# EasyEDA Pro project PCB.eprj

# Schematic Schematic1
Board Name: Board1; Create Date: 2025-12-08; Page Name: P1; Project Name: 微型显示器-401RCT6; Schematic Name: Schematic1; Update Date: 2025-12-23; Company: 嘉立创EDA; Page Size: A4; Version: V1.0
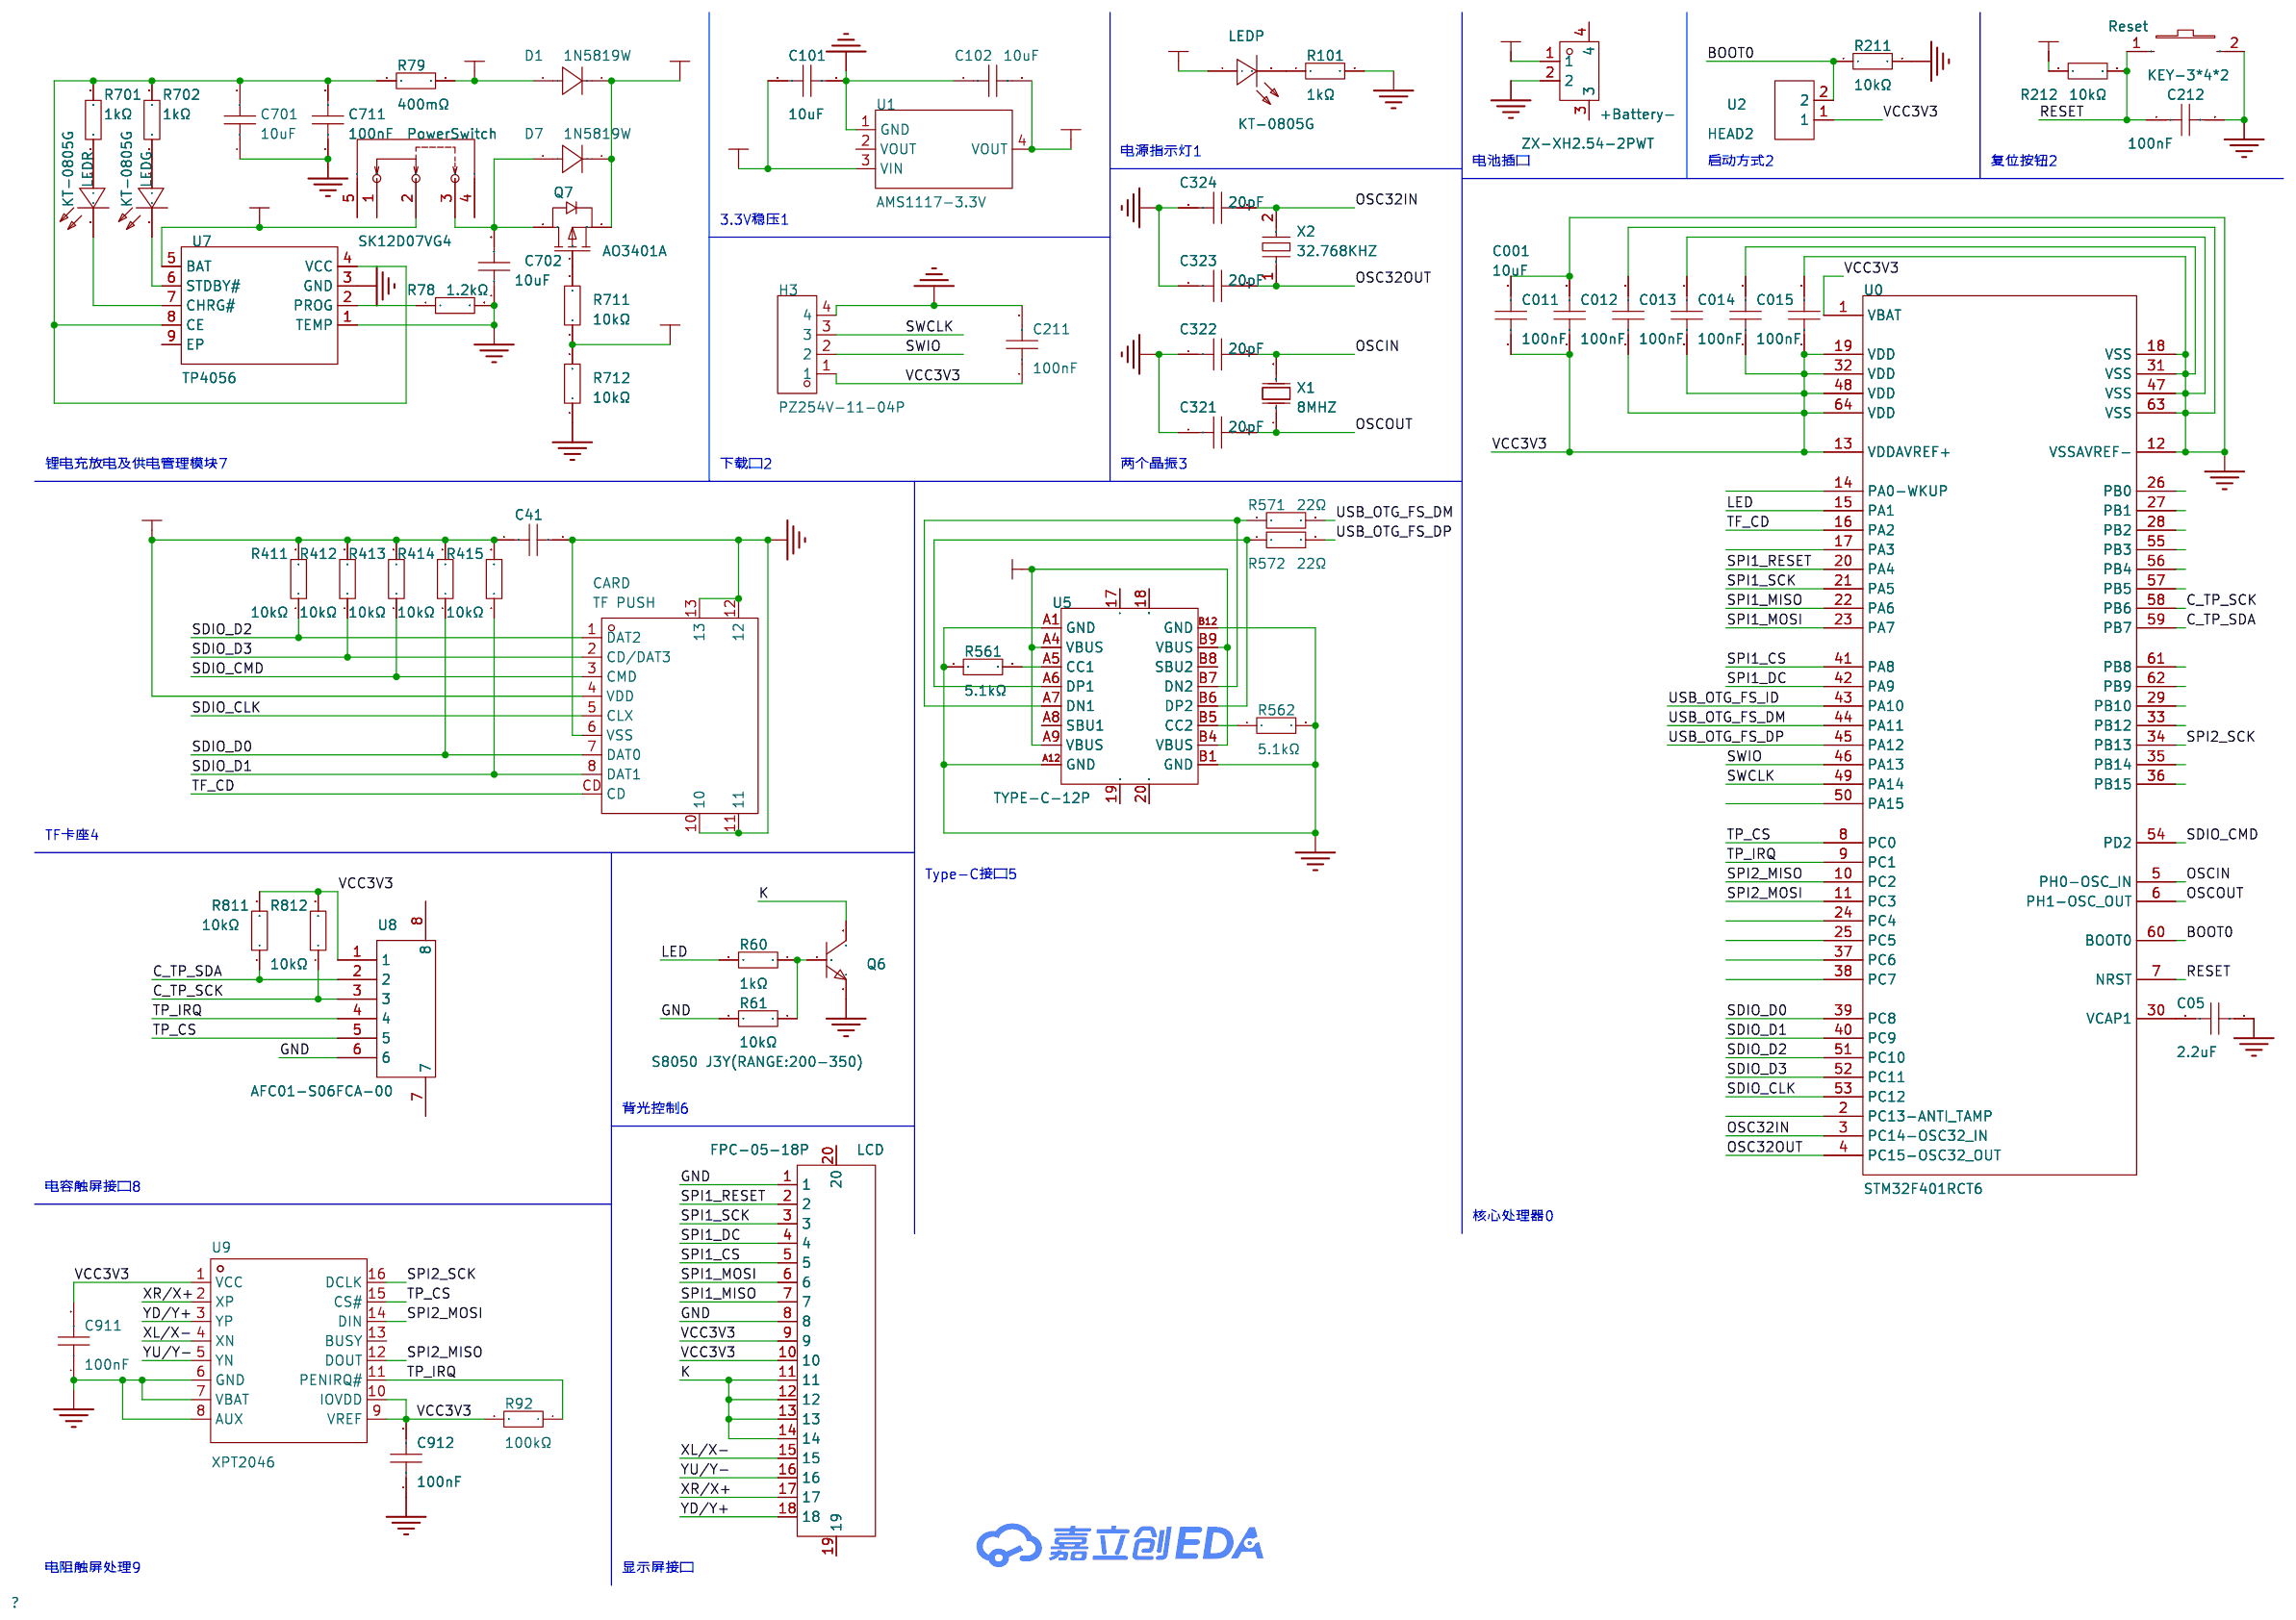
[diagram p0: schematic sheet]

## Parts
+Battery-  ZX-XH2.54-2PWT  [CONN-SMD_2P-P2.54_MEGASTAR_ZX-XH2.54-2PWT]
C001  10uF  [C0603]
C05  2.2uF  [C0603]
C011  100nF  [C0603]
C012  100nF  [C0603]
C013  100nF  [C0603]
C014  100nF  [C0603]
C015  100nF  [C0603]
C41  100nF  [C0603]
C101  10uF  [C0603]
C102  10uF  [C0603]
C211  100nF  [C0603]
C212  100nF  [C0603]
C321  20pF  [C0603]
C322  20pF  [C0603]
C323  20pF  [C0603]
C324  20pF  [C0603]
C701  10uF  [C0603]
C702  10uF  [C0603]
C711  100nF  [C0603]
C911  100nF  [C0603]
C912  100nF  [C0603]
CARD  TF PUSH  [TF-SMD_TF-PUSH]
D1  1N5819W  [SOD-123_L2.7-W1.6-LS3.7-FD]
D7  1N5819W  [SOD-123_L2.7-W1.6-LS3.7-FD]
H3  PZ254V-11-04P  [HDR-TH_4P-P2.54-V-M]
LCD  FPC-05-18P  [FPC-SMD_18P-P0.50_XW05200-18]
LEDG  KT-0805G  [LED0805-R-RD]
LEDP  KT-0805G  [LED0805-R-RD]
LEDR  KT-0805G  [LED0805-R-RD]
PowerSwitch  SK12D07VG4  [SW-TH_SK12D07VG4]
Q6  S8050 J3Y(RANGE:200-350)  [SOT-23-3_L3.0-W1.7-P0.95-LS2.9-BR]
Q7  AO3401A  [SOT-23_L2.9-W1.3-P1.90-LS2.4-BR]
R60  1kΩ  [R0603]
R61  10kΩ  [R0603]
R78  1.2kΩ  [R0603]
R79  400mΩ  [R0603]
R92  100kΩ  [R0603]
R101  1kΩ  [R0603]
R211  10kΩ  [R0603]
R212  10kΩ  [R0603]
R411  10kΩ  [R0603]
R412  10kΩ  [R0603]
R413  10kΩ  [R0603]
R414  10kΩ  [R0603]
R415  10kΩ  [R0603]
R561  5.1kΩ  [R0603]
R562  5.1kΩ  [R0603]
R571  22Ω  [R0603]
R572  22Ω  [R0603]
R701  1kΩ  [R0603]
R702  1kΩ  [R0603]
R711  10kΩ  [R0603]
R712  10kΩ  [R0603]
R811  10kΩ  [R0603]
R812  10kΩ  [R0603]
Reset  KEY-3*4*2  [SW-SMD_L4.0-W2.9-LS5.0]
U0  STM32F401RCT6  [LQFP-64_L10.0-W10.0-P0.50-LS12.0-BL]
U1  AMS1117-3.3V  [SOT-223-3_L6.5-W3.4-P2.30-LS7.0-BR]
U2  HEAD2  [HDR-TH_2P-P2.54-V-M]
U5  TYPE-C-12P  [USB-SMD_TYPE-C16PIN]
U7  TP4056  [ESOP-8_L4.9-W3.9-P1.27-LS6.0-BL-EP3.1]
U8  AFC01-S06FCA-00  [FPC-SMD_P0.50-6P_AFC01-S06FCA-00]
U9  XPT2046  [TSSOP-16_L5.0-W4.4-P0.65-LS6.4-BL]
X1  8MHZ  [HC-49S_L11.5-W5.0-P4.88]
X2  32.768KHZ  [CRYSTAL-SMD_L3.2-W1.5-1]

## Library data of the parts
+Battery- = ZX-XH2.54-2PWT: 插针结构:1x2P;间距:2.5mm;安装方式:卧贴;参考系列:XH;总PIN数:2P;排数:1;每排PIN数:2;行距:-;额定电流:3A;触头材质:黄铜;触头镀层:锡;工作温度:-25℃~+85℃;; LCSC Part Name: 1x2P 间距:2.5mm 卧贴 系列:XH; Supplier Part: C7429671; Manufacturer: Megastar(兆星); Supplier Footprint: SMD,P=2.5mm,卧贴; JLCPCB Part Class: 扩展库; Datasheet: https://item.szlcsc.com/datasheet/ZX-XH2.54-2PWT/8427588.html; Supplier: LCSC; Pins Structure: 1x2P; Pitch: 2.5mm; Mounting Type: 卧贴; Reference Series: XH; Number of Pins: 2P; Number of Rows: 1; Number of PINs Per Row: 2; Current Rating: 3A; Contact Material: 黄铜; Contact Plating: 锡; Operating Temperature: -25℃~+85℃; Voltage Rating: 250V; Supplementary Features: 辅助焊脚; Color: 米色; Z-Height of the Board: 6.2mm; X-Length of Bottom Edge on Board (Spacing Line): 10mm; Y-Width of Bottom Edge on Board: 10.5mm
C001 C101 C102 C701 C702 = CGA0603X5R106K100JT: 容值:10uF;精度:±10%;额定电压:10V;温度系数:X5R;; LCSC Part Name: 10uF ±10% 10V; Supplier Part: C6119842; Manufacturer: HRE(芯声); Supplier Footprint: 0603; JLCPCB Part Class: Extended Part; Supplier: LCSC; Tolerance: ±10%; Voltage Rating: 10V; Temperature Coefficient: X5R
C05 = CL10A225KO8NNNC: LCSC Part Name: 2.2uF ±10% 16V; Supplier Part: C23630; Manufacturer: SAMSUNG(三星); Supplier Footprint: 0603; JLCPCB Part Class: Basic Part; Datasheet: https://item.szlcsc.com/datasheet/CL10A225KO8NNNC/24366.html; Supplier: LCSC; Tolerance: ±10%; Voltage Rating: 16V; Temperature Coefficient: X5R
C011 C012 C013 C014 C015 C41 C211 C212 C711 C911 C912 = CGA0603X7R104K500JT: 容值:100nF;精度:±10%;额定电压:50V;温度系数:X7R;; LCSC Part Name: 100nF ±10% 50V; Supplier Part: C6119867; Manufacturer: HRE(芯声); Supplier Footprint: 0603; JLCPCB Part Class: Extended Part; Datasheet: https://atta.szlcsc.com/upload/public/pdf/source/20250103/C44077DA9E7B3EFAE02F22B6D3D1CBC9.pdf; Supplier: LCSC; Tolerance: ±10%; Voltage Rating: 50V; Temperature Coefficient: X7R
C321-C324 = CC0603JRNPO9BN200: 容值:20pF;精度:±5%;额定电压:50V;材质(温度系数):NP0;; LCSC Part Name: 20pF ±5% 50V; Supplier Part: C105621; Manufacturer: YAGEO(国巨); Supplier Footprint: 0603; JLCPCB Part Class: Extended Part; Datasheet: https://atta.szlcsc.com/upload/public/pdf/source/20170505/1493957838062.pdf; Supplier: LCSC; Tolerance: ±5%; Voltage Rated: 50V; Temperature Coefficient: NP0
CARD = TF PUSH: 卡连接方式:自弹式;卡类型:MicroSD卡(TF卡);连接器类型:卡座;本体最大高度:2mm;工作温度:-25℃~+90℃;; LCSC Part Name: 自弹式 MicroSD卡(TF卡) 卡座; Supplier Part: C393941; Manufacturer: SHOU HAN(首韩); Supplier Footprint: SMD; JLCPCB Part Class: 扩展库; Datasheet: https://item.szlcsc.com/datasheet/TF%2520PUSH/372553.html; Supplier: LCSC; Card Connection Mode: 自弹式; Card Type: MicroSD卡(TF卡); Connector Type: 卡座; Additional Card Detection Pins: 无; Height Above Board: 2mm; Operating Temperature: -25℃~+90℃
D1 D7 = 1N5819W_C5451628: 二极管配置:独立式;正向压降(Vf):600mV@200mA;直流反向耐压(Vr):40V;整流电流:350mA;; LCSC Part Name: 电压:40V 电流:350mA; Supplier Part: C5451628; Manufacturer: HXY MOSFET(华轩阳电子); Supplier Footprint: SOD-123; JLCPCB Part Class: Extended Part; Datasheet: https://item.szlcsc.com/datasheet/1N5819W/6355371.html; Supplier: LCSC; Diode Configuration: 独立式; Voltage - Forward(Vf@If): 600mV@200mA; Voltage - DC Reverse(Vr): 40V; Current - Rectified: 350mA; Reverse Leakage Current (Ir): 5uA@30V
H3 = PZ254V-11-04P_C492403: LCSC Part Name: 1x4P 间距:2.54mm 方针 直插; Supplier Part: C492403; Manufacturer: XFCN(兴飞); Supplier Footprint: 插件,P=2.54mm; JLCPCB Part Class: Extended Part; Datasheet: https://atta.szlcsc.com/upload/public/pdf/source/20200309/C492403_F9F19131791D08044AD4F84F8E751A34.pdf; Supplier: LCSC; Pin Structure: 1x4P; Pitch: 2.54mm; Circluar Pins/Square Pins: 方针; Mounting Type: 直插; Number of Rows: 单排; Number of Pins: 4P; Length of Mating Pin: 6mm; Insulation Height: 2.5mm; Length of End Connection Pin: 3mm; Contact Material: 黄铜; Operating Temperature: -40℃~+105℃; Color: 黑色
LCD = FPC-05-18P: Supplier Part: C9900014287; JLCPCB Part Class: Extended Part; Supplier: LCSC
LEDG LEDP LEDR = KT-0805G: 灯头类型:-;发光颜色:翠绿色;正向压降(Vf):2.6V~3.1V;功率:100mW;正向电流:5mA;波长:513nm~528nm;二极管配置:-;透镜颜色:-;色温:-;发光强度:430mcd;发光角度:120°;载带方式:-;工作温度:-40℃~+85℃;; LCSC Part Name: 0805 翠绿 高亮; Supplier Part: C2297; Manufacturer: KENTO; Supplier Footprint: 0805; JLCPCB Part Class: 基础库; Datasheet: https://item.szlcsc.com/datasheet/KT-0805G/2670.html; Supplier: LCSC; Illumination Color: 翠绿色; Voltage - Forward(Vf): 2.6V~3.1V; Power(Watts): 100mW; Forward Current: 5mA; Wavelength - Dominant: 513nm~528nm; Peak Wavelength: 525nm; Luminous Intensity: 430mcd; Viewing Angle: 120°; Operating Temperature: -40℃~+85℃
PowerSwitch = SK12D07VG4: 电路结构:单刀双掷;安装方式:-;额定电流:500mA;额定电压:50V;工作寿命:5千次;; LCSC Part Name: 3脚2档位 卧插 滑动开关; Supplier Part: C393937; Manufacturer: SHOU HAN(首韩); Supplier Footprint: 插件; JLCPCB Part Class: 扩展库; Datasheet: https://item.szlcsc.com/datasheet/SK12D07VG4/372549.html; Supplier: LCSC; Circuit: 单刀双掷; Actuator Style: 矩形柱状; Termination Style: PC引脚; Switch Height: 8.8mm; Current Rating: 500mA; Voltage Rating: 50V; Life: 5千次; Length: 8.7mm
Q6 = S8050 J3Y(RANGE:200-350): LCSC Part Name: H档(200-350) NPN 电流:0.5A 电压:25V; Supplier Part: C2146; Manufacturer: CJ(江苏长电/长晶); Supplier Footprint: SOT-23; JLCPCB Part Class: 基础库; Datasheet: https://item.szlcsc.com/datasheet/S8050%2520J3Y(RANGE%253A200-350)/2503.html; Supplier: LCSC; type: NPN; Current - Collector(Ic): 500mA; Collector - Emitter Voltage VCEO: 25V; Pd - Power Dissipation: 300mW; DC Current Gain: 200@500mA,1V; Transition frequency(fT): 150MHz; Current - Collector Cutoff: 100nA; Vce Saturation(VCE(sat)): 600mV@500mA,50mA; Operating Temperature: -55℃~+150℃; Emitter-Base Voltage(Vebo): 5V; Number: 1个NPN
Q7 = AO3401A_C347476: 数量:1个P沟道;漏源电压(Vdss):30V;连续漏极电流(Id):4.2A;导通电阻(RDS(on)):50mΩ@10V;耗散功率(Pd):1.4W;阈值电压(Vgs(th)):1.3V@250uA;; LCSC Part Name: 1个P沟道 耐压:30V 电流:4.2A; Supplier Part: C347476; Manufacturer: UMW(友台半导体); Supplier Footprint: SOT-23; JLCPCB Part Class: 扩展库; Datasheet: https://item.szlcsc.com/datasheet/AO3401A/324136.html; Supplier: LCSC; Number: 1个P沟道; Drain to Source Voltage: 30V; Current - Continuous Drain(Id): 4.2A; RDS(on): 50mΩ@10V; Pd - Power Dissipation: 1.4W; Gate Threshold Voltage (Vgs(th)): 1.3V@250uA; Gate Charge(Qg): 9.4nC@4.5V; Input Capacitance(Ciss): 954pF; Reverse Transfer Capacitance (Crss@Vds): 77pF; Operating Temperature: -55℃~+150℃; Type: P沟道; Output Capacitance(Coss): 115pF
R60 R101 = FRC0603F1001TS: 电阻类型:厚膜电阻;阻值:1kΩ;精度:±1%;功率:100mW;工作电压:75V;温度系数:±100ppm/℃;; LCSC Part Name: 1kΩ ±1% 100mW 厚膜电阻; Supplier Part: C2907002; Manufacturer: FOJAN(富捷); Supplier Footprint: 0603; JLCPCB Part Class: Extended Part; Supplier: LCSC; Type: 厚膜电阻; Tolerance: ±1%; Power(Watts): 100mW; Voltage-Supply(Max): 75V; Temperature Coefficient: ±100ppm/℃; Operating Temperature: -55℃~+155℃
R61 R211 R212 = RCA0310KJLF: 阻值:10kΩ;精度:±5%;功率:100mW;; LCSC Part Name: 10kΩ ±5% 100mW; Supplier Part: C22369937; Manufacturer: HKR(香港电阻); Supplier Footprint: 0603; JLCPCB Part Class: Extended Part; Datasheet: https://item.szlcsc.com/datasheet/RCA0310KJLF/23848968.html; Supplier: LCSC; Tolerance: ±5%; Power(Watts): 100mW
R78 = FRC0603J122 TS: 电阻类型:厚膜电阻;阻值:1.2kΩ;精度:±5%;功率:100mW;工作电压:75V;温度系数:±100ppm/℃;; LCSC Part Name: 1.2kΩ ±5% 100mW 厚膜电阻; Supplier Part: C2907081; Manufacturer: FOJAN(富捷); Supplier Footprint: 0603; JLCPCB Part Class: Extended Part; Supplier: LCSC; Type: 厚膜电阻; Tolerance: ±5%; Power(Watts): 100mW; Voltage-Supply(Max): 75V; Temperature Coefficient: ±100ppm/℃; Operating Temperature: -55℃~+155℃
R79 = FRL0603JR400TS: 电阻类型:厚膜电阻;阻值:400mΩ;精度:±5%;功率:100mW;工作电压:100V;温度系数:±300ppm/℃;; LCSC Part Name: 400mΩ ±5% 100mW 厚膜电阻; Supplier Part: C5126106; Manufacturer: FOJAN(富捷); Supplier Footprint: 0603; JLCPCB Part Class: Extended Part; Supplier: LCSC; Type: 厚膜电阻; Tolerance: ±5%; Power(Watts): 100mW; Voltage-Supply(Max): 100V; Temperature Coefficient: ±300ppm/℃; Operating Temperature: -55℃~+155℃
R92 = RCA03100KJLF: 电阻类型:厚膜电阻;阻值:100kΩ;精度:±5%;功率:100mW;工作电压:75V;温度系数:±100ppm/℃;; LCSC Part Name: 100kΩ ±5% 100mW; Supplier Part: C22356636; Manufacturer: HKR(香港电阻); Supplier Footprint: 0603; JLCPCB Part Class: Extended Part; Datasheet: https://item.szlcsc.com/datasheet/RCA03100KJLF/23790080.html; Supplier: LCSC; Type: 厚膜电阻; Tolerance: ±5%; Power(Watts): 100mW; Voltage-Supply(Max): 75V; Temperature Coefficient: ±100ppm/℃; Operating Temperature: -55℃~+155℃
R411-R415 R711 R712 R811 R812 = RCA0310KJLF: 阻值:10kΩ;精度:±5%;功率:100mW;; LCSC Part Name: 10kΩ ±5% 100mW; Supplier Part: C22369937; Manufacturer: HKR(香港电阻); Supplier Footprint: 0603; JLCPCB Part Class: Extended Part; Datasheet: https://item.szlcsc.com/datasheet/RCA0310KJLF/23848968.html; Supplier: LCSC; Tolerance: ±5%; Power(Watts): 100mW; Type: 厚膜电阻; Voltage-Supply(Max): 75V; Temperature Coefficient: ±100ppm/℃
R561 R562 = 0603WAF5101T5E: LCSC Part Name: 5.1kΩ ±1% 100mW 厚膜电阻; Supplier Part: C23186; Manufacturer: UNI-ROYAL(厚声); Supplier Footprint: 0603; JLCPCB Part Class: Basic Part; Datasheet: https://item.szlcsc.com/datasheet/0603WAF5101T5E/23913.html; Supplier: LCSC; Type: 厚膜电阻; Tolerance: ±1%; Power(Watts): 100mW; Voltage-Supply(Max): 75V; Temperature Coefficient: ±100ppm/℃; Operating Temperature: -55℃~+155℃
R571 R572 = 0603WAF220JT5E: LCSC Part Name: 22Ω ±1% 100mW 厚膜电阻; Supplier Part: C23345; Manufacturer: UNI-ROYAL(厚声); Supplier Footprint: 0603; JLCPCB Part Class: Basic Part; Datasheet: https://atta.szlcsc.com/upload/public/pdf/source/20200306/C422600_1E6D84923E4A46A82E41ADD87F860B5C.pdf; Supplier: LCSC; Type: 厚膜电阻; Tolerance: ±1%; Power(Watts): 100mW; Overload Voltage (Max): 75V; Temperature Coefficient: ±100ppm/℃; Operating Temperature Range: -55℃~+155℃
R701 R702 = FRC0603F1001TS: 电阻类型:厚膜电阻;阻值:1kΩ;精度:±1%;功率:100mW;工作电压:75V;温度系数:±100ppm/℃;; LCSC Part Name: 1kΩ ±1% 100mW 厚膜电阻; Supplier Part: C2907002; Manufacturer: FOJAN(富捷); Supplier Footprint: 0603; JLCPCB Part Class: Extended Part; Supplier: LCSC; Type: 厚膜电阻; Tolerance: ±1%; Power(Watts): 100mW; Voltage-Supply(Max): 75V; Temperature Coefficient: ±100ppm/℃; Operating Temperature: -55℃~+155℃; Overload Voltage (Max): 75V
Reset = KEY-3*4*2: Supplier Part: C9900015662; Supplier Footprint: KEY; JLCPCB Part Class: 扩展库; Supplier: LCSC
U0 = STM32F401RCT6: LCSC Part Name: 带DSP和FPU的高性能基本型系列ARM Cortex-M4 MCU，具有256 KB Flash、84 MHz CPU和ART加速器; Supplier Part: C74524; Manufacturer: ST(意法半导体); Supplier Footprint: LQFP-64(10x10); JLCPCB Part Class: 扩展库; Datasheet: https://item.szlcsc.com/datasheet/STM32F401RCT6/75646.html; Supplier: LCSC; CPU Core: ARM-M4; CPU Maximum Speed: 84MHz; Program Storage Size: 256KB; Program Memory Type: FLASH; Number of I/O: 50; ADC (Bit): 12bit; Voltage - Supply: 1.7V~3.6V
U1 = AMS1117-3.3V_C5205141: 输出类型:固定;工作电压:15V;输出电压:3.3V;输出电流:1.2A;输出极性:正极;; LCSC Part Name: 输入18V 输出3.3V 800mA; Supplier Part: C5205141; Manufacturer: JSMSEMI(杰盛微); Supplier Footprint: SOT-223; JLCPCB Part Class: Extended Part; Datasheet: https://atta.szlcsc.com/upload/public/pdf/source/20230807/E524BD9515A5B4B5F7AFDA5AFDCDAA11.pdf; Supplier: LCSC; Output Type: 固定; Voltage - Supply: 15V; Output Voltage: 3.3V; Output Current: 1.2A; Voltage Dropout: 1.5V@(800mA); standby current: 5mA; Features: 热关断; Operating Temperature: -20℃~+85℃; Output Configuration: 正极; Power Supply Rejection Ratio (PSRR): 72dB@(120Hz); Number of Outputs: 1
U2 = HEAD2: Supplier Part: C9900010030; Supplier Footprint: HDR-TH_2P-P2.54; JLCPCB Part Class: Extended Part; Supplier: LCSC
U5 = TYPE-C-12P: Supplier Part: C9900014866; Supplier Footprint: USB_TypeC; JLCPCB Part Class: 扩展库; Supplier: LCSC
U7 = TP4056_C21713961: 工作电压:4V~6.5V;最大充电电流:1A;电池类型:锂离子/聚合物;电池节数:1;; LCSC Part Name: TP4056 1A 锂离子电池充电器; Supplier Part: C21713961; Manufacturer: GOODWORK(固得沃克); Supplier Footprint: ESOP-8; JLCPCB Part Class: Extended Part; Datasheet: https://item.szlcsc.com/datasheet/TP4056/23140154.html; Supplier: LCSC; The Chip Type: 线性充电芯片; Voltage - Supply: 4V~6.5V; Charge Current - Max: 1A; Charging Saturation Voltage: 4.2V; Type of Battery: 锂离子/聚合物; Number of Cells: 1; Operating Temperature: -40℃~+85℃
U8 = AFC01-S06FCA-00: LCSC Part Name: 间距:0.5mm P数:6P 翻盖式 下接; Supplier Part: C262655; Manufacturer: JS(钜硕电子); Supplier Footprint: SMD,P=0.5mm,卧贴; JLCPCB Part Class: Extended Part; Datasheet: https://atta.szlcsc.com/upload/public/pdf/source/20190816/C413942_2A72D1AC756EAE17EEDF756A339D4500.pdf; Supplier: LCSC; Locking Feature: 翻盖式; Contact Type: 下接; Number of Contacts: 6P; Pitch: 0.5mm; Mounting Type: 卧贴; FFC, FCB Thickness: 0.3mm; Height Above Board: 2mm
U9 = XPT2046: Supplier Part: C19076; Manufacturer: XPT(矽普特); Supplier Footprint: TSSOP-16; JLCPCB Part Class: 扩展库; Datasheet: https://item.szlcsc.com/datasheet/XPT2046/19779.html; Supplier: LCSC
X1 = 8MHZ: Supplier Part: C9900021358; Supplier Footprint: X-HC49U直插; JLCPCB Part Class: 扩展库; Supplier: LCSC
X2 = 32.768KHZ: Supplier Part: C9900023773; Supplier Footprint: FC-135; JLCPCB Part Class: 扩展库; Supplier: LCSC

## Nets
GND: +Battery-.2 C001.2 C05.1 C011.2 C012.2 C013.1 C014.2 C015.2 C41.2 C101.2 C102.1 C211.2 C212.2 C321.1 C322.1 C323.1 C324.1 C701.1 C702.1 C711.1 C911.1 C912.1 CARD.6(VSS) CARD.10 CARD.11 CARD.12 CARD.13 H3.4 LCD.1 LCD.8 Q6.2(E) R61.2 R78.2 R101.2 R211.2 R561.1 R562.2 R712.1 Reset.2 U0.12(VSSAVREF-) U0.18(VSS) U0.31(VSS) U0.47(VSS) U0.63(VSS) U1.1(GND) U5.A1(GND) U5.A12(GND) U5.B1(GND) U5.B12(GND) U7.1(TEMP) U7.3(GND) U8.6 U9.6(GND) U9.7(VBAT) U9.8(AUX)
VBAT: +Battery-.1 PowerSwitch.2 U7.5(BAT)
VBUS: D1.2(A) R79.2 R711.1 R712.2 U5.A4(VBUS) U5.A9(VBUS) U5.B4(VBUS) U5.B9(VBUS)
VCC3V3: C001.1 C011.1 C012.1 C013.2 C014.1 C015.1 C41.1 C102.2 C211.1 C911.2 C912.2 CARD.4(VDD) H3.1 LCD.9 LCD.10 LEDP.1(A) R92.2 R212.1 R411.2 R412.2 R413.2 R414.2 R415.2 R811.2 R812.2 U0.1(VBAT) U0.13(VDDAVREF+) U0.19(VDD) U0.32(VDD) U0.48(VDD) U0.64(VDD) U1.4(VOUT) U2.1 U8.1 U9.1(VCC) U9.9(VREF) U9.10(IOVDD)
BOOT0: R211.1 U0.60(BOOT0) U2.2
C_TP_SCK: R812.1 U0.58(PB6) U8.3
C_TP_SDA: R811.1 U0.59(PB7) U8.2
K: LCD.11 LCD.12 LCD.13 LCD.14 Q6.3(C)
LED: R60.2 U0.15(PA1)
OSC32IN: C324.2 U0.3(PC14-OSC32_IN) X2.2
OSC32OUT: C323.2 U0.4(PC15-OSC32_OUT) X2.1
OSCIN: C322.2 U0.5(PH0-OSC_IN) X1.2(OSC2)
OSCOUT: C321.2 U0.6(PH1-OSC_OUT) X1.1(OSC1)
RESET: C212.1 R212.2 Reset.1 U0.7(NRST)
SDIO_CLK: CARD.5(CLX) U0.53(PC12)
SDIO_CMD: CARD.3(CMD) R413.1 U0.54(PD2)
SDIO_D0: CARD.7(DAT0) R414.1 U0.39(PC8)
SDIO_D1: CARD.8(DAT1) R415.1 U0.40(PC9)
SDIO_D2: CARD.1(DAT2) R411.1 U0.51(PC10)
SDIO_D3: CARD.2(CD/DAT3) R412.1 U0.52(PC11)
SPI1_CS: LCD.5 U0.41(PA8)
SPI1_DC: LCD.4 U0.42(PA9)
SPI1_MISO: LCD.7 U0.22(PA6)
SPI1_MOSI: LCD.6 U0.23(PA7)
SPI1_RESET: LCD.2 U0.20(PA4)
SPI1_SCK: LCD.3 U0.21(PA5)
SPI2_MISO: U0.10(PC2) U9.12(DOUT)
SPI2_MOSI: U0.11(PC3) U9.14(DIN)
SPI2_SCK: U0.34(PB13) U9.16(DCLK)
SWCLK: H3.3 U0.49(PA14)
SWIO: H3.2 U0.46(PA13)
TF_CD: CARD.CD U0.16(PA2)
TP_CS: U0.8(PC0) U8.5 U9.15(CS#)
TP_IRQ: R92.1 U0.9(PC1) U8.4 U9.11(PENIRQ#)
USB_OTG_FS_DM: R571.2 U0.44(PA11)
USB_OTG_FS_DP: R572.2 U0.45(PA12)
USB_OTG_FS_ID: U0.43(PA10)
VOUT: C101.1 D1.1(K) D7.1(K) Q7.2(S) U1.3(VIN)
XL/X-: LCD.15 U9.4(XN)
XR/X+: LCD.17 U9.2(XP)
YD/Y+: LCD.18 U9.3(YP)
YU/Y-: LCD.16 U9.5(YN)
$1N3566: Q7.1(G) R711.2
$1N3568: C702.2 D7.2(A) PowerSwitch.3 Q7.3(D)
$1N3569: R78.1 U7.2(PROG)
$1N3572: C701.2 C711.2 R79.1 R701.2 R702.2 U7.4(VCC) U7.8(CE)
$1N3577: LEDR.2(K) U7.7(CHRG#)
$1N3578: LEDG.2(K) U7.6(STDBY#)
$1N3579: LEDG.1(A) R702.1
$1N3580: LEDR.1(A) R701.1
$1N8049: Q6.1(B) R60.1 R61.1
$1N21734: LEDP.2(K) R101.1
$1N30360: C05.2 U0.30(VCAP1)
Net-(R561-2): R561.2 U5.A5(CC1)
Net-(R562-1): R562.1 U5.B5(CC2)
Net-(R571-1): R571.1 U5.A7(DN1) U5.B7(DN2)
Net-(R572-1): R572.1 U5.A6(DP1) U5.B6(DP2)

Not connected (* = marked no-connect by the designer): +Battery- 3 4; LCD 19 20; PowerSwitch 1 4 5; U0 2(PC13-ANTI_TAMP) 14(PA0-WKUP) 17(PA3) 24(PC4) 25(PC5) 26(PB0) 27(PB1) 28(PB2) 29(PB10) 33(PB12) 35(PB14) 36(PB15) 37(PC6) 38(PC7) 50(PA15) 55(PB3) 56(PB4) 57(PB5) 61(PB8) 62(PB9); U1 2(VOUT); U5 17 18 19 20 A8(SBU1) B8(SBU2); U7 9(EP); U8 7 8; U9 13(BUSY)

## Notes on the sheet
- 电源指示灯1
- 电池插口
- 启动方式2
- 复位按钮2
- 3.3V稳压1
- 锂电充放电及供电管理模块7
- 下载口2
- 两个晶振3
- TF卡座4
- Type-C接口5
- 背光控制6
- 电容触屏接口8
- 核心处理器0
- 电阻触屏处理9
- 显示屏接口

# Board PCB1
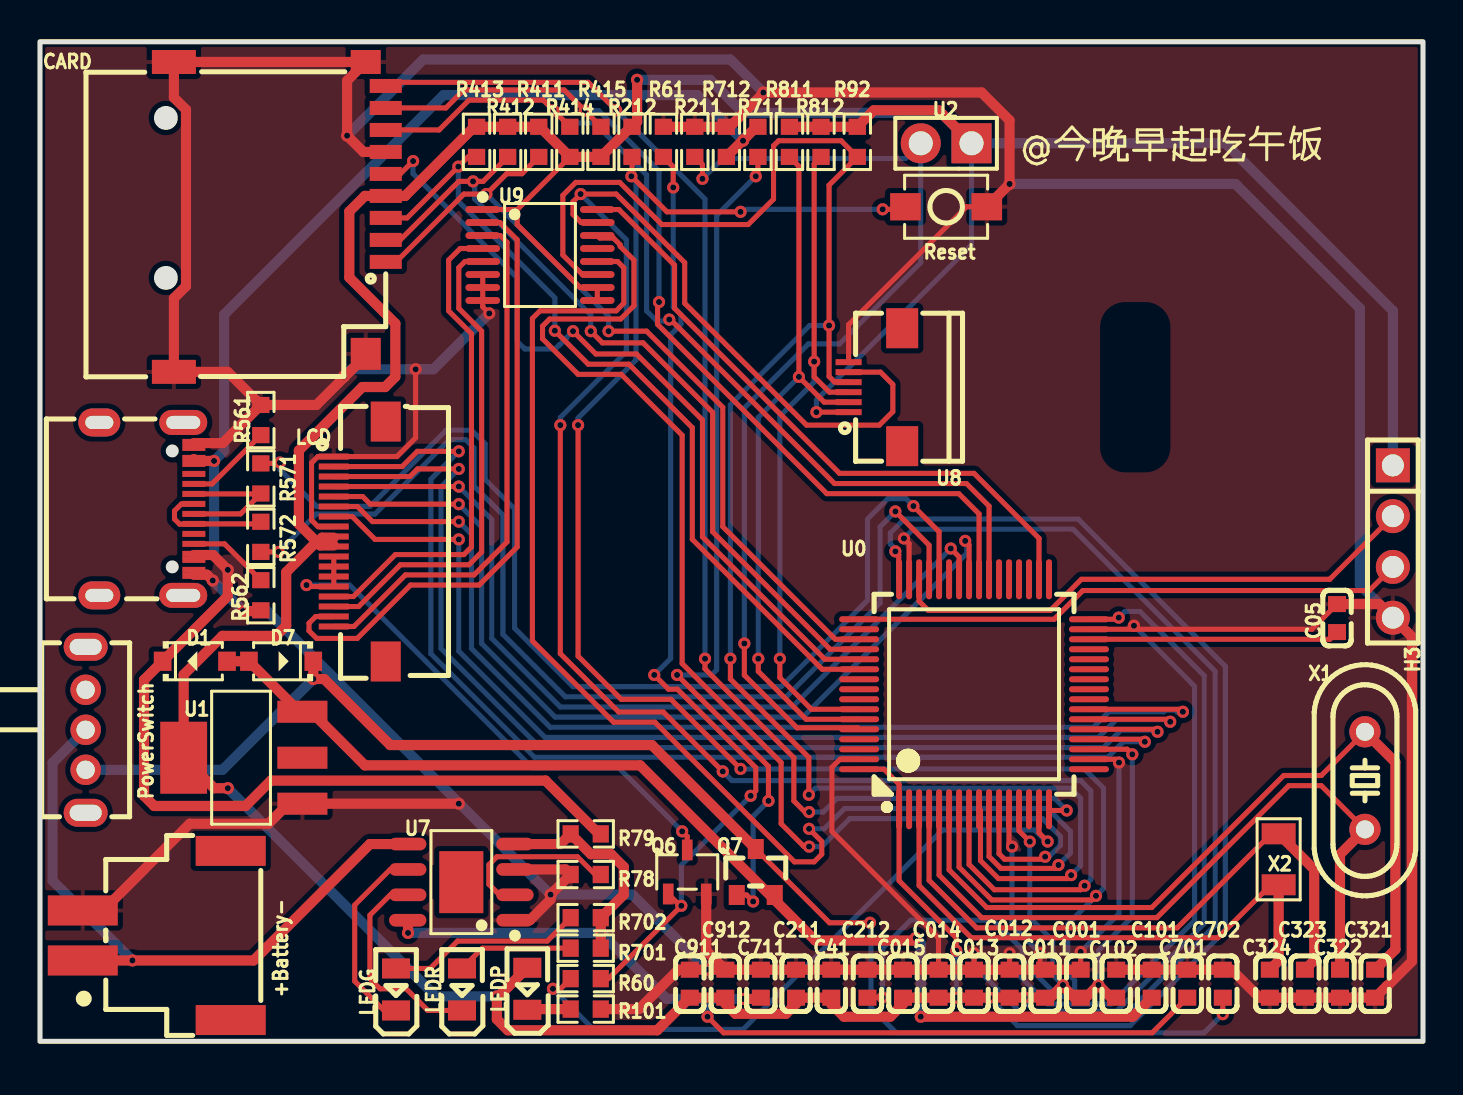
[diagram p1: board, top side]
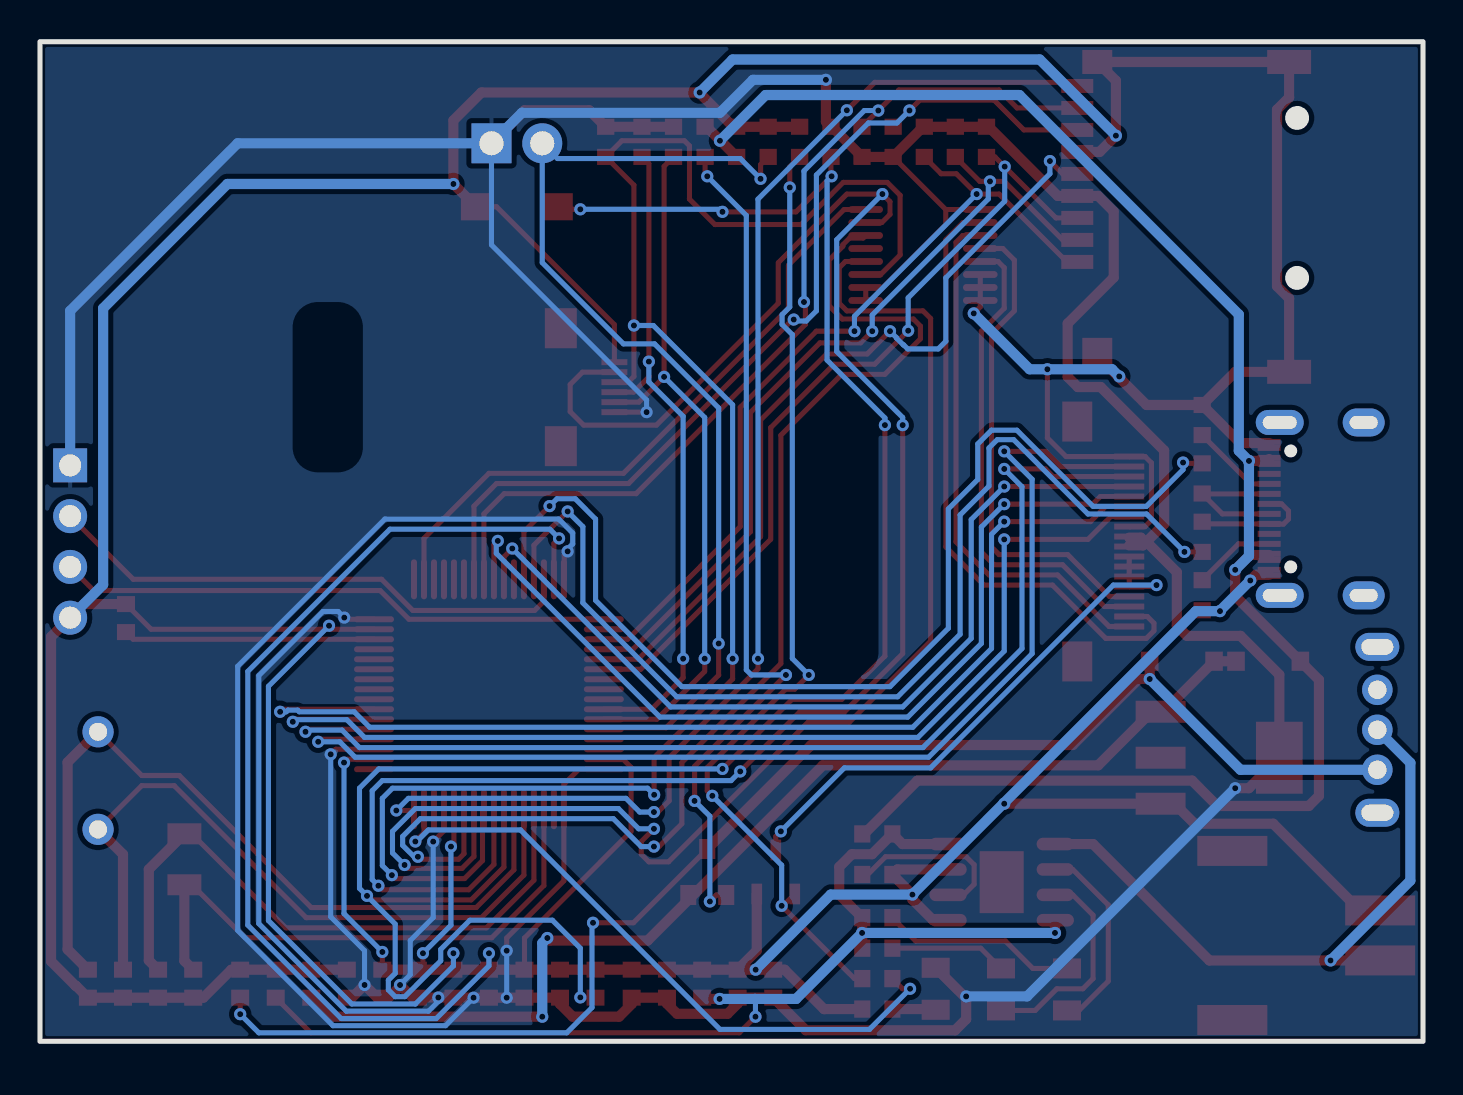
[diagram p2: board, bottom side, seen from below]

Outline 69.2 x 50 mm; copper layers: Top Layer, Bottom Layer. Coordinates in mm from the lower left corner of the outline.
Outline path: rectangle 0,50 69.2,0
Stack: Top Layer 0.035mm / Dielectric1 1.51mm FR4 er 4.5 / Bottom Layer 0.035mm

## Design rules (mm)
template: JLCPCB Capability(Two Layers Board)
spacing copperThickness1oz (default): track to track 0.102, other pairs 0.152 to 0.3
spacing copperThickness2oz: track to track 0.203, other pairs 0.152 to 0.3
track width copperThickness1oz (default): min 0.127, default 0.254, max 2.54
track width copperThickness2oz: min 0.203, default 0.254, max 2.54
differential pair differentialPair (default): width min 0.127, default 0.254, max 2.54; gap min 0.152, default 0.152
via viaSize (default): diameter min 0.5, default 0.61, max 10; hole min 0.3, default 0.305, max 6.3

## Placement (name value [footprint] x y rotation side)
+Battery-  ZX-XH2.54-2PWT  [CONN-SMD_2P-P2.54_MEGASTAR_ZX-XH2.54-2PWT]  5.84 5.3 90 top
@今晚早起吃午饭  TYPE-C-12P  [USB-SMD_TYPE-C16PIN]  5.33 26.63 270 top
C001  10uF  [C0603]  52.07 2.88 90 top
C05  2.2uF  [C0603]  64.9 21.17 270 top
C011  100nF  [C0603]  50.29 2.88 90 top
C012  100nF  [C0603]  48.51 2.88 90 top
C013  100nF  [C0603]  46.74 2.88 270 top
C014  100nF  [C0603]  44.96 2.88 90 top
C015  100nF  [C0603]  43.18 2.88 90 top
C41  100nF  [C0603]  39.59 2.88 90 top
C101  10uF  [C0603]  55.63 2.88 90 top
C102  10uF  [C0603]  53.85 2.88 270 top
C211  100nF  [C0603]  37.83 2.88 90 top
C212  100nF  [C0603]  41.4 2.88 90 top
C321  20pF  [C0603]  66.8 2.88 90 top
C322  20pF  [C0603]  65.05 2.88 90 top
C323  20pF  [C0603]  63.29 2.88 90 top
C324  20pF  [C0603]  61.53 2.88 90 top
C701  10uF  [C0603]  57.4 2.88 270 top
C702  10uF  [C0603]  59.18 2.88 270 top
C711  100nF  [C0603]  36.07 2.88 270 top
C911  100nF  [C0603]  32.51 2.88 270 top
C912  100nF  [C0603]  34.29 2.88 270 top
CARD  TF PUSH  [TF-SMD_TF-PUSH]  12 41.24 270 top
D1  1N5819W  [SOD-123_L2.7-W1.6-LS3.7-FD]  7.75 19.01 180 top
D7  1N5819W  [SOD-123_L2.7-W1.6-LS3.7-FD]  12.06 19.01 0 top
H3  PZ254V-11-04P  [HDR-TH_4P-P2.54-V-M]  67.69 25 270 top
LCD  FPC-05-18P  [FPC-SMD_18P-P0.50_XW05200-18]  16 25 90 top
LEDG  KT-0805G  [LED0805-R-RD]  17.81 2.59 90 top
LEDP  KT-0805G  [LED0805-R-RD]  24.38 2.63 90 top
LEDR  KT-0805G  [LED0805-R-RD]  21.12 2.59 90 top
PowerSwitch  SK12D07VG4  [SW-TH_SK12D07VG4]  2.29 15.58 270 top
Q6  S8050 J3Y(RANGE:200-350)  [SOT-23-3_L3.0-W1.7-P0.95-LS2.9-BR]  32.38 8.47 270 top
Q7  AO3401A  [SOT-23_L2.9-W1.3-P1.90-LS2.4-BR]  35.81 8.47 270 top
R60  1kΩ  [R0603]  27.31 3.14 180 top
R61  10kΩ  [R0603]  31.19 44.99 90 top
R78  1.2kΩ  [R0603]  27.31 8.34 180 top
R79  400mΩ  [R0603]  27.31 10.38 0 top
R92  100kΩ  [R0603]  40.89 44.99 90 top
R101  1kΩ  [R0603]  27.31 1.61 0 top
R211  10kΩ  [R0603]  32.76 44.99 90 top
R212  10kΩ  [R0603]  29.62 44.99 270 top
R411  10kΩ  [R0603]  24.96 44.99 90 top
R412  10kΩ  [R0603]  23.4 44.99 90 top
R413  10kΩ  [R0603]  21.84 44.99 90 top
R414  10kΩ  [R0603]  26.51 44.99 270 top
R415  10kΩ  [R0603]  28.07 44.99 270 top
R561  5.1kΩ  [R0603]  11.05 31.08 270 top
R562  5.1kΩ  [R0603]  11.05 22.31 270 top
R571  22Ω  [R0603]  11.05 28.16 90 top
R572  22Ω  [R0603]  11.05 25.23 270 top
R701  1kΩ  [R0603]  27.31 4.66 0 top
R702  1kΩ  [R0603]  27.31 6.19 0 top
R711  10kΩ  [R0603]  35.92 44.99 270 top
R712  10kΩ  [R0603]  34.34 44.99 270 top
R811  10kΩ  [R0603]  37.5 44.99 90 top
R812  10kΩ  [R0603]  39.08 44.99 90 top
Reset  KEY-3*4*2  [SW-SMD_L4.0-W2.9-LS5.0]  45.34 41.75 0 top
U0  STM32F401RCT6  [LQFP-64_L10.0-W10.0-P0.50-LS12.0-BL]  46.74 17.36 0 top
U1  AMS1117-3.3V  [SOT-223-3_L6.5-W3.4-P2.30-LS7.0-BR]  10.16 14.19 0 top
U2  HEAD2  [HDR-TH_2P-P2.54-V-M]  45.34 44.92 180 top
U7  TP4056  [ESOP-8_L4.9-W3.9-P1.27-LS6.0-BL-EP3.1]  21.08 7.96 90 top
U8  AFC01-S06FCA-00  [FPC-SMD_P0.50-6P_AFC01-S06FCA-00]  41.8 32.72 90 top
U9  XPT2046  [TSSOP-16_L5.0-W4.4-P0.65-LS6.4-BL]  25.02 39.33 270 top
X1  8MHZ  [HC-49S_L11.5-W5.0-P4.88]  66.29 13.04 270 top
X2  32.768KHZ  [CRYSTAL-SMD_L3.2-W1.5-1]  61.98 9.11 270 top

## Footprints (pads in the part's own frame, mm; a bottom-side part is the same pattern mirrored in y, then rotated)
C0603
  rect 0.8x0.9 smd: 1(-0.7,0) 2(0.7,0)
CONN-SMD_2P-P2.54_MEGASTAR_ZX-XH2.54-2PWT
  rect 1.5x3.5 smd: 1(-1.25,3.7) 2(1.25,3.7) 3(-4.23,-3.7) 4(4.23,-3.7)
CRYSTAL-SMD_L3.2-W1.5-1
  rect 1.05x1.7 smd: 1(-1.275,0) 2(1.275,0)
ESOP-8_L4.9-W3.9-P1.27-LS6.0-BL-EP3.1
  oval 0.63x1.865 smd: 1(-1.905,-2.683) 2(-0.635,-2.683) 3(0.635,-2.683) 4(1.905,-2.683) 5(1.905,2.683) 6(0.635,2.683) 7(-0.635,2.683) 8(-1.905,2.683)
  rect 3.1x2.2 smd: 9(0,0)
FPC-SMD_18P-P0.50_XW05200-18
  rect 0.3x1.5 smd: 1(4.25,1.3) 2(3.75,1.3) 3(3.25,1.3) 4(2.75,1.3) 5(2.25,1.3) 6(1.75,1.3) 7(1.25,1.3) 8(0.75,1.3) 9(0.25,1.3) 10(-0.25,1.3) 11(-0.75,1.3) 12(-1.25,1.3) 13(-1.75,1.3) 14(-2.25,1.3) 15(-2.75,1.3) 16(-3.25,1.3) 17(-3.75,1.3) 18(-4.25,1.3)
  rect 2x1.5 smd: 19(-6,-1.3) 20(6,-1.3)
FPC-SMD_P0.50-6P_AFC01-S06FCA-00
  rect 0.3x1.3 smd: 1(-1.248,1.339) 2(-0.748,1.339) 3(-0.248,1.339) 4(0.252,1.339) 5(0.752,1.339) 6(1.252,1.339)
  rect 2x1.6 smd: 7(-2.95,-1.339) 8(2.95,-1.339)
HC-49S_L11.5-W5.0-P4.88
  round 1.56 hole 0.9: 1(-2.44,0) 2(2.44,0)
HDR-TH_2P-P2.54-V-M
  rect 2x2 hole 1.2: 1(-1.27,0)
  round 2 hole 1.2: 2(1.27,0)
HDR-TH_4P-P2.54-V-M
  rect 1.7x1.7 hole 1.1: 1(-3.81,0)
  round 1.7 hole 1.1: 2(-1.27,0) 3(1.27,0) 4(3.81,0)
LED0805-R-RD
  rect 1x1.399 smd: 1(1.05,0) 2(-1.05,0)
LQFP-64_L10.0-W10.0-P0.50-LS12.0-BL
  oval 0.3x2 smd: 1(-3.75,-5.75) 2(-3.25,-5.75) 3(-2.75,-5.75) 4(-2.25,-5.75) 5(-1.75,-5.75) 6(-1.25,-5.75) 7(-0.75,-5.75) 8(-0.25,-5.75) 9(0.25,-5.75) 10(0.75,-5.75) 11(1.25,-5.75) 12(1.75,-5.75) 13(2.25,-5.75) 14(2.75,-5.75) 15(3.25,-5.75) 16(3.75,-5.75) 33(3.75,5.75) 34(3.25,5.75) 35(2.75,5.75) 36(2.25,5.75) 37(1.75,5.75) 38(1.25,5.75) 39(0.75,5.75) 40(0.25,5.75) 41(-0.25,5.75) 42(-0.75,5.75) 43(-1.25,5.75) 44(-1.75,5.75) 45(-2.25,5.75) 46(-2.75,5.75) 47(-3.25,5.75) 48(-3.75,5.75)
  oval 2x0.3 smd: 17(5.75,-3.75) 18(5.75,-3.25) 19(5.75,-2.75) 20(5.75,-2.25) 21(5.75,-1.75) 22(5.75,-1.25) 23(5.75,-0.75) 24(5.75,-0.25) 25(5.75,0.25) 26(5.75,0.75) 27(5.75,1.25) 28(5.75,1.75) 29(5.75,2.25) 30(5.75,2.75) 31(5.75,3.25) 32(5.75,3.75) 49(-5.75,3.75) 50(-5.75,3.25) 51(-5.75,2.75) 52(-5.75,2.25) 53(-5.75,1.75) 54(-5.75,1.25) 55(-5.75,0.75) 56(-5.75,0.25) 57(-5.75,-0.25) 58(-5.75,-0.75) 59(-5.75,-1.25) 60(-5.75,-1.75) 61(-5.75,-2.25) 62(-5.75,-2.75) 63(-5.75,-3.25) 64(-5.75,-3.75)
R0603
  rect 0.806x0.864 smd: 1(-0.753,0) 2(0.753,0)
SOD-123_L2.7-W1.6-LS3.7-FD
  rect 0.88x0.96 smd: 1(-1.61,0) 2(1.61,0)
SOT-23-3_L3.0-W1.7-P0.95-LS2.9-BR
  rect 1.038x0.532 smd: 1(1.101,-0.95) 2(1.101,0.95) 3(-1.101,0)
SOT-23_L2.9-W1.3-P1.90-LS2.4-BR
  rect 1x0.8 smd: 1(1.15,-0.95) 2(1.15,0.95) 3(-1.15,0)
SOT-223-3_L6.5-W3.4-P2.30-LS7.0-BR
  rect 2.5x1.1 smd: 1(2.97,-2.3) 2(2.97,0) 3(2.97,2.3)
  rect 2.34x3.6 smd: 4(-2.97,0)
SW-SMD_L4.0-W2.9-LS5.0
  rect 1.53x1.36 smd: 1(-2.035,0) 2(2.035,0)
SW-TH_SK12D07VG4
  round 1.524 hole 0.914: 1(-2,0) 2(0,0) 3(2,0)
  oval 1.4x2.2 hole 0.8x1.6: 4(4.15,0) 5(-4.15,0)
TF-SMD_TF-PUSH
  rect 0.7x1.6 smd: 1(2.25,5.3) 2(1.15,5.3) 3(0.05,5.3) 4(-1.05,5.3) 5(-2.15,5.3) 6(-3.25,5.3) 7(-4.35,5.3) 8(-5.45,5.3) CD(-6.55,5.3)
  rect 1.2x1.5 smd: 10(-7.75,4.3)
  rect 1.2x2.2 smd: 11(-7.75,-5.3) 12(7.75,-5.3)
  rect 1.6x1.5 smd: 13(6.85,4.3)
TSSOP-16_L5.0-W4.4-P0.65-LS6.4-BL
  oval 0.343x1.732 smd: 1(-2.275,-2.866) 2(-1.625,-2.866) 3(-0.975,-2.866) 4(-0.325,-2.866) 5(0.325,-2.866) 6(0.975,-2.866) 7(1.625,-2.866) 8(2.275,-2.866) 9(2.275,2.866) 10(1.625,2.866) 11(0.975,2.866) 12(0.325,2.866) 13(-0.325,2.866) 14(-0.975,2.866) 15(-1.625,2.866) 16(-2.275,2.866)
USB-SMD_TYPE-C16PIN
  oval 1.25x2.4 hole 0.65x1.7: 17(-4.325,1.835) 18(4.325,1.835)
  oval 1.4x2.1 hole 0.65x1.4: 19(-4.325,-2.365) 20(4.325,-2.365)
  rect 0.3x1.15 smd: A1(-3.35,2.365) A4(-2.55,2.365) A5(-1.25,2.365) A6(-0.25,2.365) A7(0.25,2.365) A8(1.25,2.365) A9(2.55,2.365) A12(3.35,2.365) B1(3.05,2.365) B4(2.25,2.365) B5(1.75,2.365) B6(0.75,2.365) B7(-0.75,2.365) B8(-1.75,2.365) B9(-2.25,2.365) B12(-3.05,2.365)

## Nets
As in the schematic, except:
GND: +Battery-.2 @今晚早起吃午饭.A1 @今晚早起吃午饭.A12 @今晚早起吃午饭.B1 @今晚早起吃午饭.B12 C001.2 C05.1 C011.2 C012.2 C013.1 C014.2 C015.2 C41.2 C101.2 C102.1 C211.2 C212.2 C321.1 C322.1 C323.1 C324.1 C701.1 C702.1 C711.1 C911.1 C912.1 CARD.6 CARD.10 CARD.11 CARD.12 CARD.13 H3.4 LCD.1 LCD.8 Q6.2 R61.2 R78.2 R101.2 R211.2 R561.1 R562.2 R712.1 Reset.2 U0.12 U0.18 U0.31 U0.47 U0.63 U1.1 U7.1 U7.3 U8.6 U9.6 U9.7 U9.8
VBUS: @今晚早起吃午饭.A4 @今晚早起吃午饭.A9 @今晚早起吃午饭.B4 @今晚早起吃午饭.B9 D1.2 R79.2 R711.1 R712.2
$1N32508: @今晚早起吃午饭.A6 @今晚早起吃午饭.B6 R572.1
$1N32510: @今晚早起吃午饭.B5 R562.1
$1N32516: @今晚早起吃午饭.A5 R561.2
$1N35567: @今晚早起吃午饭.A7 @今晚早起吃午饭.B7 R571.1

Pads without a net: +Battery- 3 4; @今晚早起吃午饭 17 18 19 20 A8 B8; LCD 19 20; PowerSwitch 1 4 5; U1 2; U7 9; U8 7 8; U9 13

## Via types
v1: diameter 0.61, hole 0.305, Top Layer to Bottom Layer, 115 vias

## Routing (per net, layer and track width the routed paths; a pad name or vN(x,y) marks a point on that pad's centre or on a via; arc(x,y) is an arc through that point)
GND: length 421.4
  Top Layer w0.254: U8.6 40.46,35.85 46.35,41.75 Reset.2 ; U9.6 U9.7 U9.8 22.15,36.74 v1(22.48,36.41) ; U0.18 53.82,14.11 v1(53.99,13.94) ; C014.2 44.96,5.17 39.62,10.5 39.62,13.71 40.03,14.11 U0.63 ; U0.31 63.64,20.61 C05.1 ; v1(50.04,4.41) 50.04,3.84 C011.2 ; v1(48.51,4.41) C012.2 ; LCD.8 14.69,25.74 13.91,25.74 13.59,26.07 13.59,28.93 13.91,29.25 LCD.1 17.86,29.25 18.8,30.19 v1(18.8,33.62) ; v1(48.64,9.74) 48.49,9.89 U0.12 ; v1(43.23,25.16) 43.49,24.9 U0.47 ; v1(46.74,4.41) C013.1 ; C001.2 v1(52.07,4.47)
  Top Layer w0.508: U7.1 24.51,6.06 25.55,7.09 v1(25.55,7.34) R78.2 26.3,8.6 U7.3 ; 7.7,29.93 9.14,29.93 R561.1 ; R561.1 13.83,31.83 16.3,34.3 CARD.13 ; R561.1 9.39,33.49 CARD.12 6.7,37.16 7.31,37.77 7.31,46.6 6.7,47.21 CARD.11 CARD.10 15.37,48.05 v1(15.37,45.3) 16.18,44.49 CARD.6 ; 33.34,7.37 33.34,4.54 C912.1 ; C05.1 67.01,21.87 H3.4 68.65,20.23 68.65,4 67.42,2.78 67.4,2.78 C321.1 C322.1 C323.1 C324.1 61.03,2.18 59.62,3.58 C702.1 C701.1 C101.2 C102.1 ; 7.7,23.34 8.36,23.34 v1(8.64,23.05) ; v1(10.16,21.52) 11.01,21.52 R562.2 ; v1(20.96,11.89) U1.1 12.43,11.89 11.43,10.88 7.49,10.88 3.16,6.55 +Battery-.2 ; C912.1 C711.1 C211.2 C41.2 C212.2 C015.2 C014.2 C013.1 C012.2 C011.2 C001.2 ; C912.1 v1(33.39,3.58) C911.1 31.94,3.58 29.97,1.61 R101.2 ; Reset.2 v1(48.51,42.89) 48.51,46.06 47.12,47.46 36.23,47.46 34.51,45.75 R712.1 R211.2 R61.2
  Bottom Layer w0.254: v1(50.04,4.41) 48.64,5.81 v1(48.64,9.74) ; v1(52.07,4.47) 53.99,6.39 v1(53.99,13.94) ; v1(48.51,4.41) 48.51,3.77 50.42,1.87 53.59,1.87 57.77,6.04 57.77,17.76 v1(54.74,20.79) ; v1(46.74,4.41) 46.74,3.78 49.38,1.14 54.13,1.14 58.8,5.81 58.8,18.5 51.69,25.62 43.69,25.62 v1(43.23,25.16)
  Bottom Layer w0.508: v1(36.19,47.46) 34.54,49.11 19.18,49.11 v1(15.37,45.3) ; v1(48.51,42.89) 59.82,42.89 66.04,36.67 66.04,22.84 H3.4 ; v1(15.2,33.26) 15.56,33.62 v1(18.8,33.62) 19.69,33.62 v1(22.48,36.41) ; v1(33.39,3.58) 29.63,7.34 v1(25.55,7.34) 11.37,21.52 v1(10.16,21.52) 10.16,21.54 v1(8.64,23.05)
VBAT: length 32.5
  Top Layer w0.508: U7.5 16.51,9.87 10.69,4.05 v1(4.63,4.05) +Battery-.1
  Bottom Layer w0.508: v1(4.63,4.05) 0.64,8.04 0.64,13.93 PowerSwitch.2
VBUS: length 87.7
  Top Layer w0.508: v1(8.71,29.03) 7.79,29.03 7.7,29.13 ; 7.7,24.33 8.66,24.33 v1(9.4,23.58) 9.4,22.27 D1.2 5.21,18.08 5.21,12.28 5.72,11.77 10.29,11.77 11.56,13.04 25.29,13.04 27.96,10.38 R79.2 ; R711.1 35.85,45.75 34.34,44.24
  Bottom Layer w0.508: v1(9.4,23.58) 8.71,24.27 v1(8.71,29.03) 9.22,29.54 9.22,36.36 20.19,47.33 32.89,47.33 v1(35.18,45.05)
VCC3V3: length 326.5
  Top Layer w0.254: 27.88,37.06 27.88,37.71 27.03,37.71 23.88,40.85 23.88,41.61 ; 23.88,41.61 26.51,44.24 ; 23.88,41.61 U9.1 ; v1(49.53,9.99) 48.99,10.53 U0.13 ; v1(54.65,14.36) 54.4,14.61 U0.19 ; v1(53.97,21.19) 53.89,21.11 U0.32 ; v1(38.85,31.47) U8.1 ; U0.48 42.97,23.09 42.97,24.34 v1(42.8,24.51) ; v1(45.85,4.53) 45.85,5.17 42.99,8.03 U0.1 42.99,12.86 42.23,13.61 U0.64
  Top Layer w0.508: 14.7,25.19 14.12,25.19 13.88,24.95 ; 14.7,24.81 14.02,24.81 13.88,24.95 ; 13.88,24.95 12.95,25.87 12.95,29.55 16.13,32.73 17.27,32.73 17.78,33.24 17.78,35.9 15.48,38.21 15.48,41.51 16.26,42.29 18.27,42.29 21.73,45.75 R413.2 R412.2 R411.2 25,45.75 26.51,44.24 28.07,44.24 29.57,45.75 R212.1 29.88,46 v1(29.88,48.09) ; 13.88,24.95 13.8,24.95 12.32,23.47 12.32,20.79 11.81,20.28 9.13,20.28 7.19,18.34 U1.4 8.71,12.66 v1(9.4,12.66) ; C102.2 53.59,2.18 v1(52.96,2.82) 52.26,2.12 51.82,2.12 51.19,2.75 v1(51.19,2.82) 50.56,2.19 v1(49.27,2.19) 47.51,2.19 v1(47.51,2.18) C013.2 v1(45.85,2.18) C014.1 C015.1 43.18,1.87 42.54,1.23 40.23,1.23 39.59,1.87 C41.1 C211.1 37.83,1.88 37.32,1.38 34.8,1.38 34.29,1.88 C912.2 C911.2 30.88,0.55 23.41,0.55 22.86,1.1 22.86,2.16 LEDP.1 ; R811.2 R812.2 R92.2 41.72,46.57 44.96,46.57 U2.1
  Bottom Layer w0.254: v1(42.8,24.51) 42.8,24.62 42.54,24.88 42.54,25.42 43.24,26.12 51.94,26.12 59.31,18.76 59.31,5.55 54.54,0.78 48.91,0.78 v1(47.51,2.18) ; v1(54.65,14.36) 54.65,6.23 52.96,4.53 v1(52.96,2.82) ; v1(49.27,2.19) 49.27,2 49.76,1.51 53.87,1.51 58.25,5.89 58.25,18.29 55.04,21.5 54.28,21.5 v1(53.97,21.19) ; v1(49.53,9.99) 49.53,6.19 50.67,5.04 50.67,3.33 v1(51.19,2.82) ; v1(38.85,31.47) 38.85,32.08 46.61,39.84 U2.1 ; v1(45.85,2.18) v1(45.85,4.53)
  Bottom Layer w0.508: H3.1 67.69,36.54 59.31,44.92 U2.1 45.09,46.44 35.18,46.44 33.53,48.09 v1(29.88,48.09) ; v1(9.4,12.66) 19.81,2.25 v1(22.86,2.25)
BOOT0: length 50.9
  Top Layer w0.254: U0.60 40.91,15.68 37.88,15.68 35.24,18.32 v1(35.24,19.9) ; 32.76,44.24 33.15,43.86 v1(33.15,43.14)
  Bottom Layer w0.254: v1(33.15,43.14) 34.16,44.16 43.31,44.16 U2.2 44.07,38.95 40,34.89 38.45,34.89 35.24,31.68 v1(35.24,19.9)
C_TP_SCK: length 34.3
  Top Layer w0.254: U8.3 39.5,32.47 38.74,33.24 v1(38.74,34) 38.74,43.9 39.08,44.24 ; v1(37.02,19.14) 37.02,18.19 38.6,16.61 U0.58
  Bottom Layer w0.254: v1(37.02,19.14) 37.02,31.27 38.74,32.98 v1(38.74,34)
C_TP_SDA: length 35.8
  Top Layer w0.254: U8.2 39.24,31.97 v1(37.97,33.24) 37.97,43.77 37.5,44.24 ; v1(35.94,19.14) 35.94,18.5 38.33,16.11 U0.59
  Bottom Layer w0.254: v1(35.94,19.14) 35.94,31.2 v1(37.97,33.24)
K: length 27.8
  Top Layer w0.254: v1(13.33,22.82) 13.41,22.75 LCD.14 LCD.13 LCD.12 LCD.11 ; v1(32.13,10.5) 32.38,10.25 Q6.3
  Bottom Layer w0.254: v1(13.33,22.82) 15.49,22.82 24.64,13.68 28.96,13.68 v1(32.13,10.5)
LED: length 32.9
  Top Layer w0.254: R60.2 26.04,2.63 v1(25.67,2.63) ; U0.15 49.99,10.43 v1(50.42,10)
  Bottom Layer w0.254: v1(50.42,10) 50.35,10 49.77,10.57 45.16,10.57 35.18,0.6 27.7,0.6 v1(25.67,2.63)
OSC32IN: length 28.4
  Top Layer w0.254: 61.98,7.83 61.59,7.83 58.94,5.18 46.6,5.18 43.99,7.79 U0.3
  Top Layer w0.508: C324.2 61.98,4.03 61.98,7.83
OSC32OUT: length 31.7
  Top Layer w0.254: U0.4 44.49,8.05 46.86,5.68 56.9,5.68 61.6,10.38 X2.1
  Top Layer w0.508: X2.1 63.75,8.6 63.75,4.05 C323.2
OSCIN: length 36.7
  Top Layer w0.254: X1.2 64.11,12.79 62.48,12.79 55.88,6.19 47.12,6.19 44.99,8.32 U0.5
  Top Layer w0.508: X1.2 65.05,9.35 C322.2
OSCOUT: length 41.2
  Top Layer w0.254: X1.1 64.11,13.3 62.23,13.3 55.63,6.69 47.37,6.69 45.49,8.58 U0.6
  Top Layer w0.508: X1.1 67.82,13.96 67.82,4.6 C321.2
RESET: length 106.8
  Top Layer w0.254: v1(42.16,2.2) 41.42,2.2 C212.1 ; v1(35.05,41.49) 31.37,41.49 v1(29.59,43.27) 29.62,43.3 29.62,44.24 ; v1(42.16,41.62) 43.18,41.62 Reset.1 ; U0.7 45.99,8.71 47.62,7.07 52.63,7.07 v1(52.84,7.28) ; v1(26.92,30.82) 26.92,19.27 29.08,17.11 31.57,17.11 v1(35.05,13.63)
  Bottom Layer w0.254: v1(42.16,2.2) 42.16,4.66 43.56,6.06 47.69,6.06 49.15,4.6 49.15,4.03 50.94,2.23 51.43,2.23 51.77,2.58 51.77,3.06 51.43,3.4 51.43,5.87 v1(52.84,7.28) 53.21,7.65 53.21,12.66 52.25,13.63 v1(35.05,13.63) ; v1(26.92,30.82) 26.92,31.18 29.82,34.08 29.82,43.04 v1(29.59,43.27) ; v1(35.05,41.49) 35.18,41.62 v1(42.16,41.62)
SDIO_CLK: length 40.7
  Top Layer w0.254: v1(18.67,44.03) 18.03,43.39 CARD.5 ; U0.53 39.27,19.11 33.15,25.23 33.15,31.08 29.84,34.38 27.81,34.38 v1(26.67,35.52)
  Bottom Layer w0.254: v1(26.67,35.52) 26.34,35.2 26.34,35.18 26,34.83 25.98,34.83 25.78,34.63 24.26,34.63 23.88,35.01 23.88,38.19 18.67,43.4 v1(18.67,44.03)
SDIO_CMD: length 41.5
  Top Layer w0.254: 21.84,44.24 21.42,44.24 v1(20.93,43.75) 18.37,41.19 CARD.3 ; v1(25.76,35.55) 25.76,35.54 27.43,33.87 29.46,33.87 32.64,30.7 32.64,25.11 39.14,18.61 U0.54
  Bottom Layer w0.254: v1(20.93,43.75) 20.93,42.02 25.76,37.19 v1(25.76,35.55)
SDIO_D0: length 48.1
  Top Layer w0.254: R414.1 v1(25.7,46.56) 25.18,47.08 21.46,47.08 19.97,45.59 17.3,45.59 ; U0.39 47.49,26.77 46.35,27.9 39.75,27.9 31.55,36.1 v1(31.49,36.1)
  Bottom Layer w0.254: v1(25.7,46.56) 26.32,45.94 27.75,45.94 30.35,43.33 30.35,36.54 30.86,36.03 31.41,36.03 v1(31.49,36.1)
SDIO_D1: length 47.9
  Top Layer w0.254: R415.1 v1(27.26,46.56) 26.23,47.59 21.21,47.59 20.31,46.69 CARD.8 ; U0.40 46.99,26.38 45.97,27.39 39.37,27.39 30.9,35.86 30.9,36.91 v1(30.97,36.98)
  Bottom Layer w0.254: v1(27.26,46.56) 27.95,46.56 30.97,43.54 v1(30.97,36.98)
SDIO_D2: length 41.6
  Top Layer w0.254: U0.51 39.79,20.11 34.16,25.74 34.16,31.71 30.35,35.52 v1(28.45,35.52) ; 24.96,44.24 24.11,43.4 23.35,43.4 v1(22.33,42.38) 21.21,42.38 17.82,38.99 CARD.1
  Bottom Layer w0.254: v1(28.45,35.52) 28.45,36.27 v1(22.33,42.38)
SDIO_D3: length 41.3
  Top Layer w0.254: 17.3,40.09 18.03,40.09 20.96,43.02 v1(21.67,43.02) 22.18,43.02 23.4,44.24 ; U0.52 39.53,19.61 33.66,25.49 33.66,31.46 30.18,34.94 28.14,34.94 v1(27.56,35.52)
  Bottom Layer w0.254: v1(21.67,43.02) 21.75,42.93 21.75,42.14 27.56,36.33 v1(27.56,35.52)
SPI1_CS: length 45.7
  Top Layer w0.254: v1(46.29,25.03) 46.49,24.84 U0.41 ; LCD.5 16.15,27.25 16.53,26.87 v1(20.96,26.87)
  Bottom Layer w0.254: v1(46.29,25.03) 46.37,24.96 46.37,24.41 38.18,16.22 25.78,16.22 22.1,19.9 22.1,25.73 v1(20.96,26.87)
SPI1_DC: length 43.9
  Top Layer w0.254: v1(45.57,24.65) 45.99,24.23 U0.42 ; v1(20.96,27.75) LCD.4
  Bottom Layer w0.254: v1(45.57,24.65) 37.65,16.73 26.03,16.73 22.61,20.16 22.61,26.1 v1(20.96,27.75)
SPI1_MISO: length 54.2
  Top Layer w0.254: v1(20.96,25.11) 16.77,25.11 15.62,26.25 LCD.7 ; v1(56.55,15.98) 56.42,16.11 U0.22
  Bottom Layer w0.254: v1(56.55,15.98) 56.44,16.09 53.85,16.09 52.96,15.2 25.27,15.2 20.96,19.52 v1(20.96,25.11)
SPI1_MOSI: length 55.5
  Top Layer w0.254: U0.23 57.06,16.61 v1(57.19,16.48) ; LCD.6 15.88,26.75 16.64,26 v1(20.96,26)
  Bottom Layer w0.254: v1(57.19,16.48) 56.88,16.48 56.79,16.57 56.31,16.57 56.22,16.48 53.48,16.48 52.71,15.71 25.53,15.71 21.59,19.65 21.59,25.36 v1(20.96,26)
SPI1_RESET: length 58.3
  Top Layer w0.254: v1(55.28,14.98) 55.15,15.11 U0.20 ; LCD.2 18.12,28.75 18.88,29.51 v1(20.96,29.51)
  Bottom Layer w0.254: v1(55.28,14.98) 54.2,14.98 53.43,14.21 24.74,14.21 19.56,19.39 19.56,28.11 v1(20.96,29.51)
SPI1_SCK: length 57.5
  Top Layer w0.254: v1(55.91,15.48) 55.79,15.61 U0.21 ; v1(20.96,28.63) 18.89,28.63 18.51,28.25 LCD.3
  Bottom Layer w0.254: v1(20.96,28.63) 20.07,27.74 20.07,19.65 25.02,14.69 53.21,14.69 54.09,15.57 55.83,15.57 v1(55.91,15.48)
SPI2_MISO: length 67.1
  Top Layer w0.254: U0.10 47.49,9.25 48.08,8.65 50.79,8.65 v1(50.96,8.82) ; v1(38.48,10.63) 39.12,10 39.12,9.36 38.74,8.98 37.75,8.98 30.77,15.96 28.7,15.96 24.64,20.03 24.64,36.16 25.02,36.54 28.83,36.54 29.21,36.92 29.21,38.7 28.9,39.01 27.88,39.01
  Bottom Layer w0.254: v1(38.48,10.63) 39.24,10.63 40.26,11.65 50.42,11.65 51.56,10.5 51.56,9.43 v1(50.96,8.82)
SPI2_MOSI: length 62.3
  Top Layer w0.254: 27.88,40.31 28.01,40.18 28.69,40.18 29.03,39.84 29.03,39.77 29.72,39.08 29.72,36.79 29.06,36.13 25.5,36.13 25.15,35.78 25.15,35.14 26.92,33.36 29.08,33.36 32.13,30.31 32.13,18.9 37.08,13.94 37.08,10.88 38.23,9.74 v1(38.48,9.74) ; 50.29,9.11 48.26,9.11 47.99,9.38 U0.11
  Bottom Layer w0.254: v1(50.29,9.23) 50.48,9.23 51.05,9.8 51.05,10.25 50.16,11.14 40.51,11.14 39.12,9.74 v1(38.48,9.74)
SPI2_SCK: length 32.2
  Top Layer w0.254: U0.34 49.99,25.16 46.74,28.41 40,28.41 31.75,36.67 31.75,38.82 28.97,41.61 27.88,41.61
SWCLK: length 27.8
  Top Layer w0.254: U0.49 50.74,21.11 52.18,22.55 66.51,22.55 H3.3
SWIO: length 26.9
  Top Layer w0.254: H3.2 64.53,23.11 52.1,23.11 50.55,21.55 44.45,21.55 43.99,22.02 U0.46
TF_CD: length 65.7
  Top Layer w0.254: v1(28.83,46.57) 27.43,47.97 17.48,47.97 17.3,47.79 ; v1(51.37,11.55) 50.55,11.55 U0.16 ; v1(33.27,19.14) 33.27,18.63 37.72,14.19 37.72,12.03 38.28,11.47 v1(38.48,11.47)
  Bottom Layer w0.254: v1(51.37,11.55) 50.76,12.15 39.88,12.15 39.19,11.47 v1(38.48,11.47) ; v1(33.27,19.14) 33.27,42.13 v1(28.83,46.57)
TP_CS: length 97
  Top Layer w0.254: U8.5 42.06,33.47 42.67,32.86 42.67,31.5 42,30.82 38.35,30.82 32.26,36.92 32.26,38.95 28.83,42.38 v1(27.05,42.38) 26.67,42 26.67,41.36 27.08,40.96 27.88,40.96 ; v1(52.27,7.78) 52.07,7.58 47.75,7.58 46.49,8.85 U0.8 ; v1(34.16,13.5) 31.19,16.47 28.96,16.47 26.03,19.39 v1(26.03,30.82)
  Bottom Layer w0.254: v1(27.05,42.38) 29.34,40.09 29.34,34.51 26.03,31.2 v1(26.03,30.82) ; v1(34.16,13.5) 34.62,13.04 52.07,13.04 52.58,12.53 52.58,8.09 v1(52.27,7.78)
TP_IRQ: length 90.6
  Top Layer w0.254: U0.9 47.06,11.54 47.06,9.04 47.96,8.14 51.42,8.14 v1(51.59,8.31) ; U8.4 40.45,32.98 39.76,32.98 39.48,33.26 v1(39.48,35.81) 39.48,42.83 40.89,44.24 40.09,45.05 36.96,45.05 36.7,44.79 36.7,42.13 35.43,40.86 31.12,40.86 29.01,42.96 26.81,42.96 26.16,42.32 26.16,39.33 27.14,38.36 27.88,38.36 ; v1(34.54,19.14) 34.54,18.12 38.47,14.2 v1(38.47,12.33)
  Bottom Layer w0.254: v1(38.47,12.33) 38.8,12.66 51.56,12.66 52.07,12.15 52.07,8.79 v1(51.59,8.31) ; v1(34.54,19.14) 34.54,31.84 38.51,35.81 v1(39.48,35.81)
USB_OTG_FS_DM: length 55.8
  Top Layer w0.254: R571.2 11.97,28.91 v1(12.01,28.95) ; U0.44 44.99,25.49 v1(43.7,26.77)
  Bottom Layer w0.254: v1(12.01,28.95) 12.01,28.59 13.84,26.76 16.51,26.76 20.32,30.57 21.59,30.57 22.28,29.88 22.28,28.1 23.75,26.63 23.75,20.66 26.67,17.74 37.08,17.74 41.4,22.06 41.4,26.12 42.42,27.14 43.34,27.14 v1(43.7,26.77)
USB_OTG_FS_DP: length 54.2
  Top Layer w0.254: R572.2 v1(11.94,24.48) ; v1(42.8,26.5) 44.49,24.82 U0.45
  Bottom Layer w0.254: v1(42.8,26.5) 42.04,25.74 42.04,21.93 37.34,17.23 26.29,17.23 23.16,20.36 23.16,26.33 21.72,27.78 21.72,29.68 21.3,30.1 20.48,30.1 16.76,26.38 13.83,26.38 v1(11.94,24.48)
VOUT: length 56.3
  Top Layer w0.508: v1(43.81,5.17) 43.69,5.04 38.79,5.04 30.03,13.81 16.26,13.81 13.7,16.36 13.26,16.36 U1.3 12.98,16.49 D7.1 D1.1 ; C101.1 54.68,1.23 v1(44.07,1.23)
  Bottom Layer w0.508: v1(43.81,5.17) 44.07,4.92 v1(44.07,1.23)
XL/X-: length 24.7
  Top Layer w0.254: U9.4 21.03,39.66 20.45,39.08 20.45,36.54 21.59,35.39 21.59,24.73 21.21,24.35 17.78,24.35 15.68,22.25 LCD.15
XR/X+: length 31.7
  Top Layer w0.254: LCD.17 13.8,21.25 13.46,20.92 13.46,20.54 13.84,20.16 15.88,20.16 18.54,22.82 21.97,22.82 23.88,24.73 23.88,40.09 23.01,40.96 U9.2
YD/Y+: length 26.8
  Top Layer w0.254: LCD.18 15.71,20.75 18.29,23.33 21.72,23.33 23.37,24.98 23.37,39.97 23.03,40.31 22.15,40.31
YU/Y-: length 24.5
  Top Layer w0.254: LCD.16 15.95,21.75 18.03,23.84 21.46,23.84 22.1,24.47 22.1,35.52 20.96,36.67 20.96,38.7 21.26,39.01 22.15,39.01
$1N3566: length 43.1
  Top Layer w0.254: v1(35.68,7) 35.36,7.32 Q7.1 ; v1(35.81,43.27) 35.92,43.38 35.92,44.24 ; v1(31.88,18.33) 36.45,13.75 v1(36.45,12.03)
  Bottom Layer w0.254: v1(35.81,43.27) 33.86,41.31 33.86,18.58 33.6,18.33 v1(31.88,18.33) ; v1(35.68,7) 35.68,11.26 v1(36.45,12.03)
$1N3568: length 70.7
  Top Layer w0.254: v1(41.53,5.93) 39.5,5.93 35.81,9.62 ; C702.2 v1(59.18,1.36)
  Top Layer w0.508: D7.2 v1(13.67,18.12) 14.22,18.12 17.53,14.82 30.61,14.82 35.81,9.62
  Bottom Layer w0.254: v1(59.18,1.36) 58.25,0.43 42.84,0.43 41.58,1.69 41.58,5.88 v1(41.53,5.93)
  Bottom Layer w0.508: PowerSwitch.3 9.14,13.58 v1(13.67,18.12)
$1N3569: length 8.6
  Top Layer w0.254: R78.1 27.78,8.34 26.89,9.23 22.86,9.23 22.46,8.83 22.46,7.85 22.99,7.33 U7.2
$1N3572: length 56.5
  Top Layer w0.254: v1(33.4,1.23) 34.21,0.43 55.65,0.43 C701.2
  Top Layer w0.508: R701.2 R702.2 29.21,7.34 29.21,8.72 28.57,9.36 27.57,9.36 R79.1 26.04,9.87 U7.4 ; v1(35.2,2.12) 36.01,2.12 C711.2 ; v1(18.41,5.42) 18.41,6.04 U7.8
  Bottom Layer w0.254: v1(33.4,1.23) 33.4,2.11 33.41,2.12
  Bottom Layer w0.508: v1(18.41,5.42) v1(28.07,5.42) 31.37,2.12 v1(35.2,2.12)
$1N3577: length 10.8
  Top Layer w0.254: LEDR.2 19.41,1.54 18.32,2.63 17.02,2.63 16.51,3.14 16.51,6.31 17.53,7.33 U7.7
$1N3578: length 9.9
  Top Layer w0.254: U7.6 17.53,8.6 15.75,6.82 15.75,3.01 17.21,1.54 LEDG.2
$1N3579: length 9.8
  Top Layer w0.254: LEDG.1 19.52,3.64 20.89,5.02 25.38,5.02 R702.1
$1N3580: length 5.9
  Top Layer w0.254: LEDR.1 22.13,4.66 R701.1
$1N8049: length 48.7
  Top Layer w0.254: 31.19,44.24 31.68,43.75 v1(31.68,42.71) ; R60.1 28.45,3.14 v1(32.09,6.78) 32.03,6.78 Q6.1 ; v1(30.73,18.33) 31.44,17.61 31.89,17.61 35.81,13.69 35.81,12.53 v1(35.56,12.28)
  Bottom Layer w0.254: v1(31.68,42.71) 31.68,36.73 32.07,36.34 32.07,35.86 31.56,35.35 31.56,19.15 v1(30.73,18.33) ; v1(32.09,6.78) 32.09,8.81 v1(35.56,12.28)
$1N21734: length 2.2
  Top Layer w0.508: R101.1 24.42,1.61 LEDP.2
$1N30360: length 12.6
  Top Layer w0.254: U0.30 64.54,20.11 C05.2
$1N32508: length 6
  Top Layer w0.254: R572.1 10.94,25.88 @今晚早起吃午饭.B6 7.69,25.87 6.98,25.87 6.73,26.12 6.73,26.53 7.08,26.88 @今晚早起吃午饭.A6
$1N32510: length 4.1
  Top Layer w0.254: @今晚早起吃午饭.B5 9.23,24.88 R562.1
$1N32516: length 4.4
  Top Layer w0.254: R561.2 8.61,27.88 @今晚早起吃午饭.A5
$1N35567: length 7.1
  Top Layer w0.254: 11.03,27.38 11.03,27.37 10.04,26.38 @今晚早起吃午饭.A7 ; 11.03,27.38 R571.1 ; 11.03,27.38 @今晚早起吃午饭.B7

## Copper pours and planes (outline as drawn; the poured copper is in the pictures)
GND on Top Layer: 0,50 69.2,50 69.2,0 0,0
VCC3V3 on Top Layer: 0,50 69.2,50 69.2,0 0,0
VCC3V3 on Bottom Layer: 0,50 69.2,50 69.2,0 0,0
